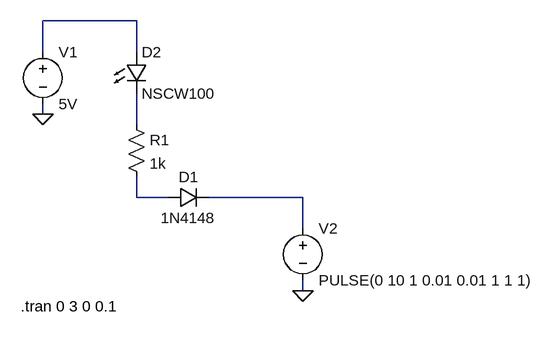
[diagram p0: schematic Led_circuit.asc]
Led_circuit.asc, the LTspice schematic file:
Version 4
SHEET 1 880 680
WIRE 176 -96 32 -96
WIRE 32 -48 32 -96
WIRE 176 -48 176 -96
WIRE 32 48 32 32
WIRE 176 64 176 16
WIRE 176 176 176 144
WIRE 224 176 176 176
WIRE 432 176 288 176
WIRE 432 224 432 176
WIRE 432 320 432 304
FLAG 32 48 0
FLAG 432 320 0
SYMBOL diode 224 192 R270
WINDOW 0 32 32 VTop 2
WINDOW 3 0 32 VBottom 2
SYMATTR InstName D1
SYMATTR Value 1N4148
SYMBOL res 160 48 R0
SYMATTR InstName R1
SYMATTR Value 1k
SYMBOL LED 160 -48 R0
SYMATTR InstName D2
SYMATTR Value NSCW100
SYMBOL voltage 32 -64 R0
WINDOW 123 0 0 Left 0
WINDOW 39 0 0 Left 0
SYMATTR InstName V1
SYMATTR Value 5V
SYMBOL voltage 432 208 R0
WINDOW 123 0 0 Left 0
WINDOW 39 0 0 Left 0
SYMATTR InstName V2
SYMATTR Value PULSE(0 10 1 0.01 0.01 1 1 1)
TEXT -2 344 Left 2 !.tran 0 3 0 0.1

The netlist it stands for:
* Led_circuit.asc
D1 N003 N004 1N4148
R1 N002 N003 1k
D2 N001 N002 NSCW100
V1 N001 0 5V
V2 N004 0 PULSE(0 10 1 0.01 0.01 1 1 1)
.model D D
.lib standard.dio
.tran 0 3 0 0.1
.backanno
.end